# Altium schematic sheet supply_domain.schdoc
size 297 x 205 mm
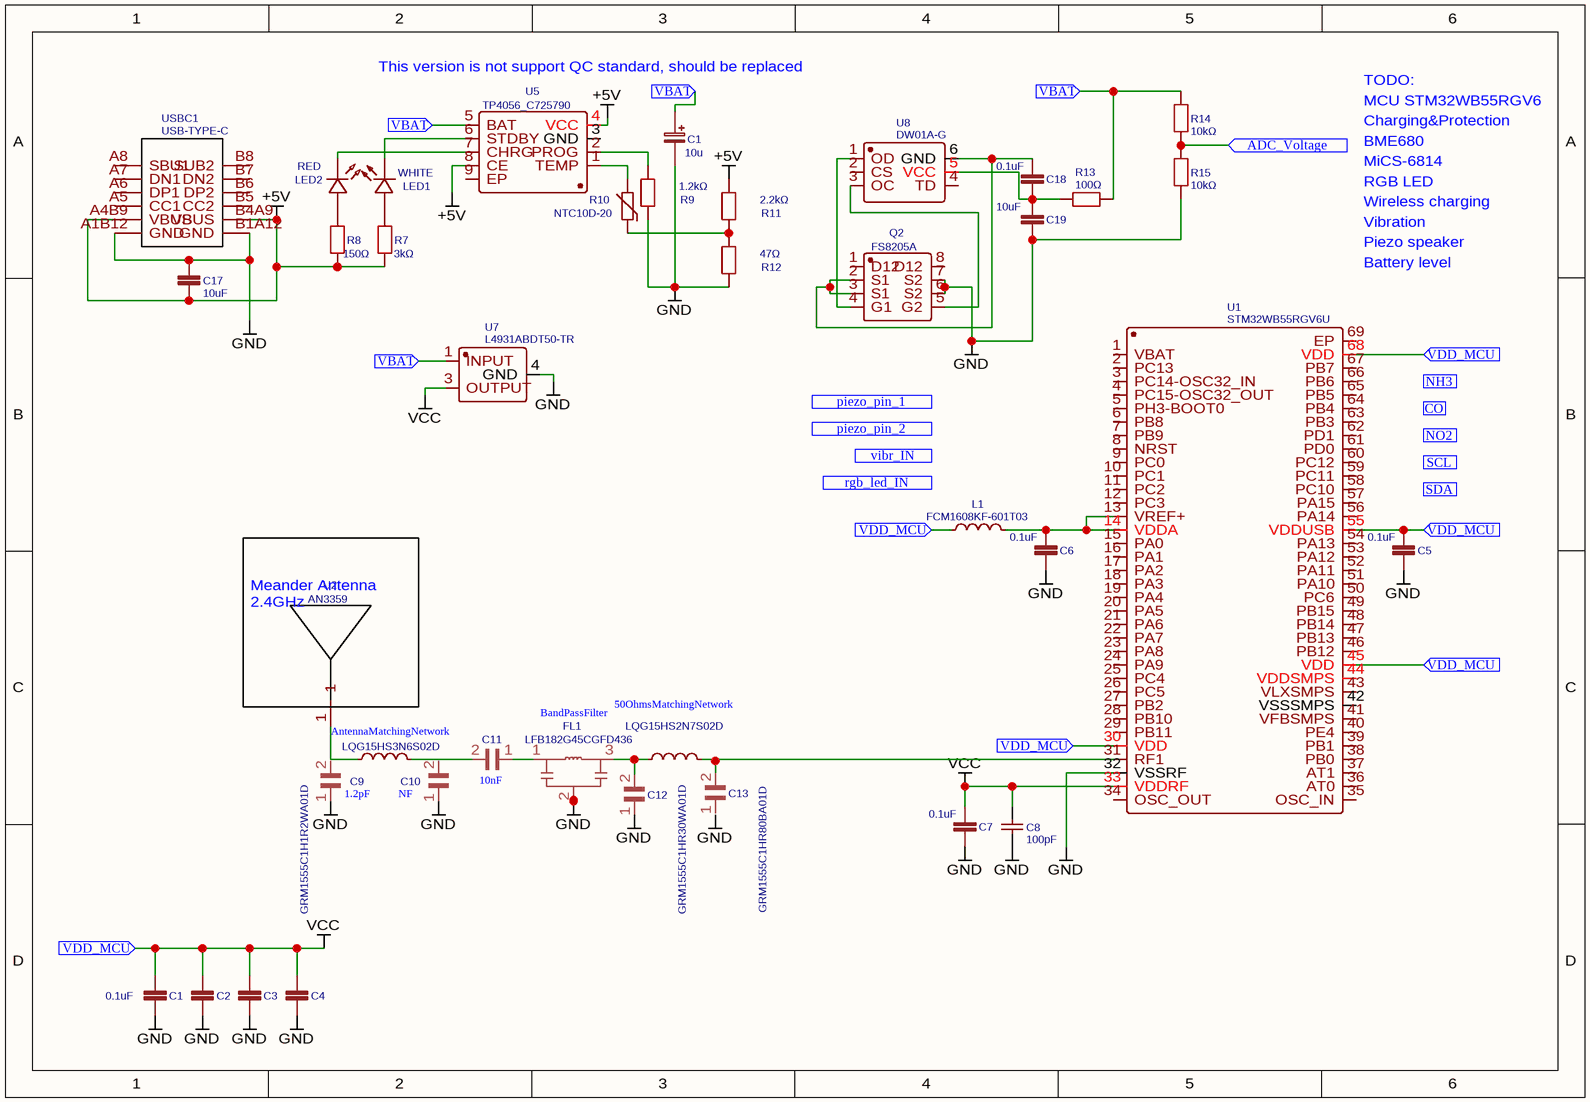
[diagram p0: supply_domain.schdoc]

## Parts
(Parts that share a designator on the sheet are numbered #1, #2 ... from top to bottom, then left to right.)
C1  0.1uF  [0603-CAP]
C2  0.1UF-25V(+80_-20%)(0603)  [0603-CAP]  (value not drawn)
C3  0.1UF-25V(+80_-20%)(0603)  [0603-CAP]  (value not drawn)
C4  0.1UF-25V(+80_-20%)(0603)  [0603-CAP]  (value not drawn)
C5  0.1uF  [0603-CAP]
C6  0.1uF  [0603-CAP]
C7  0.1uF  [0603-CAP]
C8  100pF  [C0603]
C9  GRM1555C1H1R2WA01D  [CAPC1005X55N]
C10  GRM1555C1H1R2WA01D  [CAPC1005X55N]  (value not drawn)
C11  GRM1555C1H1R2WA01D  [CAPC1005X55N]  (value not drawn)
C12  GRM1555C1HR30WA01D  [CAPC1005X55N]
C13  GRM1555C1HR80BA01D  [CAPC1005X55N]
C17  10uF  [0603-CAP]
C18  0.1uF  [0603-CAP]
C19  10uF  [0603-CAP]
FL1  LFB182G45CGFD436  [FIL_LFB182G45CGFD436]
L1  FCM1608KF-601T03  [L0603]
LED1  WHITE  [LED0805-FD]
LED2  RED  [LED0603-RD]
NO#1  LQG15HS3N6S02D  [L0402]
NO#2  LQG15HS2N7S02D  [L0402]
Q2  FS8205A  [TSSOP-8_L4.4-W3.0-P0.65-LS6.4-BL-2]
R7  3kΩ  [R0603]
R8  150Ω  [R0603]
R9  1.2kΩ  [R0603]
R10  NTC10D-20  [RES-TH_L22.0-W7.0-P7.50-D1.0-S1.00]
R11  2.2kΩ  [R0603]
R12  47Ω  [R0603]
R13  100Ω  [R0603]
R14  10kΩ  [R0603]
R15  10kΩ  [R0603]
U1  STM32WB55RGV6U  [VFQFPN-68_L8.0-W8.0-P0.40-TL-EP6.4]
U2  AN3359  [AN3359]
U5  TP4056_C725790  [ESOP-8_L4.9-W3.9-P1.27-LS6.0-BL-EP]
U6  electrolitic_cap_th_to_smd  [TH_CAP_TO_SMD]  (value not drawn)
U7  L4931ABDT50-TR  [DPAK_L6.5-W6.0-P2.29-LS9.9-BR]
U8  DW01A-G  [SOT-23-6_L2.9-W1.6-P0.95-LS2.8-BR]
USBC1  USB-TYPE-C  [USB-TYPE-C_20PIN-FEMALE_TYPE-C-31-M-14]

## Ports
ADC_Voltage (in), CO (in), NH3 (in), NO2 (in), piezo_pin_1 (in), piezo_pin_2 (in), rgb_led_IN (in), SCL (in), SDA (in), VBAT (in), VDD_MCU (in), vibr_IN (in)

## Nets
+5V: C17.1 R7.1 R8.1 R11.2 U5.4(VCC) U5.8(CE) USBC1.A4B9(VBUS) USBC1.B4A9(VBUS)
GND: C1.1 C1.2 C2.1 C2.2 C3.1 C3.2 C4.1 C4.2 C5.1 C5.2 C6.2 C7.1 C7.2 C8.1 C8.2 C9.1 C10.1 C12.1 C17.2 C19.2 FL1.2(GND) FL1.2_1(GND) L1.1 Q2.6(S2) Q2.7(S2) R9.1 R12.1 R15.2 U1.30(VDD) U1.32(VSSRF) U1.33(VDDRF) U1.45(VDD) U1.55(VDDUSB) U1.68(VDD) U6.2 U7.3(OUTPUT) U7.4(GND) USBC1.A1B12(GND) USBC1.B1A12(GND) ; port VDD_MCU  [also labelled VCC]
ADC_Voltage: R14.2 R15.1 ; port ADC_Voltage
AntennaMatchingNetwork: NO#1.1 U2.1
VBAT: R13.1 R14.1 U5.5(BAT) U6.1 U7.1(INPUT) ; port VBAT
NetC6_1: C6.1 L1.2 U1.13(VREF+) U1.14(VDDA)
NetC11_1: C11.1 FL1.1(IN)
NetC11_2: C11.2 NO#1.2
NetC12_2: C12.2 FL1.3(OUT) NO#2.1
NetC13_2: C13.2 NO#2.2 U1.31(RF1)
NetC18_1: C18.1 Q2.2(S1) Q2.3(S1) U8.6(GND)
NetC18_2: C18.2 C19.1 R13.2 U8.5(VCC)
NetLED1_1: LED1.1(A) R7.2
NetLED1_2: LED1.2(K) U5.6(STDBY)
NetLED2_1: LED2.1 U5.7(CHRG)
NetLED2_2: LED2.2 R8.2
NetQ2_4: Q2.4(G1) U8.1(OD)
NetQ2_5: Q2.5(G2) U8.3(OC)
NetR9_2: R9.2 U5.2(PROG)
NetR10_1: R10.1 R11.1 R12.2
NetR10_2: R10.2 U5.1(TEMP)

Not connected (* = marked no-connect by the designer): C9 2; C10 2; C13 1; Q2 1(D12) 8(D12); U1 1(VBAT) 2(PC13) 3(PC14-OSC32_IN) 4(PC15-OSC32_OUT) 5(PH3-BOOT0) 6(PB8) 7(PB9) 8(NRST) 9(PC0) 10(PC1) 11(PC2) 12(PC3) 15(PA0) 16(PA1) 17(PA2) 18(PA3) 19(PA4) 20(PA5) 21(PA6) 22(PA7) 23(PA8) 24(PA9) 25(PC4) 26(PC5) 27(PB2) 28(PB10) 29(PB11) 34(OSC_OUT) 35(OSC_IN) 36(AT0) 37(AT1) 38(PB0) 39(PB1) 40(PE4) 41(VFBSMPS) 42(VSSSMPS) 43(VLXSMPS) 44(VDDSMPS) 46(PB12) 47(PB13) 48(PB14) 49(PB15) 50(PC6) 51(PA10) 52(PA11) 53(PA12) 54(PA13) 56(PA14) 57(PA15) 58(PC10) 59(PC11) 60(PC12) 61(PD0) 62(PD1) 63(PB3) 64(PB4) 65(PB5) 66(PB6) 67(PB7) 69(EP); U5 3(GND) 9(EP); U8 2(CS) 4(TD); USBC1 A5(CC1) A6(DP1) A7(DN1) A8(SBU1) B5(CC2) B6(DP2) B7(DN2) B8(SUB2)

## Notes on the sheet
- This version is not support QC standard, should be replaced
- MCU STM32WB55RGV6
- TODO:
- Charging&Protection
- BME680
- MiCS-6814
- RGB LED
- Wireless charging
- Vibration
- Piezo speaker
- Battery level
- (near U2) Meander Antenna
  2.4GHz
- Labels drawn without touching a wire or pin: 1.2pF, 10nF, 50OhmsMatchingNetwork, BandPassFilter, GND, NF
- (in symbol electrolitic_cap_th_to_smd) C1; 10u

## Library data of the parts
C1 C5-C7 C18 = 0.1uF: description: CAP-00810; Contributor: SparkFun; spicePre: C; spiceSymbolName: 0.1UF-25V(+80_-20%)(0603)
C2-C4 = 0.1UF-25V(+80_-20%)(0603): description: CAP-00810; Contributor: SparkFun; spicePre: C; spiceSymbolName: 0.1UF-25V(+80_-20%)(0603)
C8 = 100pF: BOM_Manufacturer Part: GRM1885C1H101JA01D; BOM_Manufacturer: MuRata; nameAlias: Capacitance; BOM_Supplier: LCSC; BOM_Supplier Part: C71664; BOM_JLCPCB Part Class: Extended Part; spicePre: C; spiceSymbolName: GRM1885C1H101JA01D
C9-C11 = GRM1555C1H1R2WA01D: Contributor: Anderson Macedo; spicePre: C; spiceSymbolName: GRM1555C1H1R2WA01D
C12 = GRM1555C1HR30WA01D: Contributor: Anderson Macedo; spicePre: C; spiceSymbolName: GRM1555C1HR30WA01D
C13 = GRM1555C1HR80BA01D: Contributor: Anderson Macedo; spicePre: C; spiceSymbolName: GRM1555C1HR80BA01D
C17 C19 = 10uF: description: CAP-00810; Contributor: SparkFun; spicePre: C; spiceSymbolName: 0.1UF-25V(+80_-20%)(0603)
FL1 = LFB182G45CGFD436: Contributor: Anderson Macedo; spicePre: F; spiceSymbolName: LFB182G45CGFD436
L1 = FCM1608KF-601T03: BOM_Manufacturer: TAITEC; Contributor: LCSC; BOM_Supplier: LCSC; BOM_Supplier Part: C141723; BOM_Manufacturer Part: FCM1608KF-601T03; BOM_JLCPCB Part Class: Extended Part; spicePre: L; spiceSymbolName: FCM1608KF-601T03
LED1 = WHITE: BOM_Manufacturer: KENTO; BOM_Manufacturer Part: whiteLEDSMD; BOM_Supplier: LCSC; BOM_Supplier Part: C34499; BOM_JLCPCB Part Class: Basic Part; spicePre: L; spiceSymbolName: whiteLEDSMD
LED2 = RED: BOM_Manufacturer: null; BOM_Manufacturer Part: 贴片LED; Contributor: LCSC; BOM_Supplier: LCSC; BOM_Supplier Part: C9900008128; BOM_JLCPCB Part Class: Extended Part; spicePre: U; spiceSymbolName: 贴片LED_C9900008128
NO#1 = LQG15HS3N6S02D: BOM_Manufacturer: MuRata; Contributor: cyrilledecourtois; BOM_Température: -55 +125°C; BOM_Valeur: 3.6nH; BOM_Prix: 0.085; BOM_Manufacturer Part: LQG15HS3N6S02D; BOM_Supplier: Mouser; BOM_Supplier Part: 81-LQG15HS3N6S02D; link: https://www.mouser.fr/ProductDetail/Murata-Electronics/LQG15HS3N6S02D?qs=%2Fha2pyFadujBRa%2Fp5CVwGzDiTwg7pAvUcar2Z1OiPA%2FfvOHatjByeQ%3D%3D; spicePre: L; spiceSymbolName: LQG15HS3N6S02D
NO#2 = LQG15HS2N7S02D: BOM_Manufacturer: MuRata; Contributor: cyrilledecourtois; BOM_Température: -55 +125°C; BOM_Valeur: 2.7nH; BOM_Prix: 0.085; BOM_Manufacturer Part: LQG15HS2N7S02D; BOM_Supplier: Mouser; BOM_Supplier Part: 81-LQG15HS2N7S02D; link: https://www.mouser.fr/ProductDetail/Murata-Electronics/LQG15HS2N7S02D?qs=%2Fha2pyFadujt2OiWqNJoxRoxw7kBv0%252ByrT6n939VFw4zHSInabTFCw%3D%3D; spicePre: L; spiceSymbolName: LQG15HS2N7S02D
Q2 = FS8205A: BOM_Manufacturer: FORTUNE; BOM_Supplier: LCSC; BOM_Manufacturer Part: FS8205A; BOM_Supplier Part: C16052; BOM_JLCPCB Part Class: Extended Part; spicePre: Q; spiceSymbolName: FS8205A
R7 = 3kΩ: BOM_Manufacturer: Resistor.Today; BOM_Manufacturer Part: TCTR0603F47K0F3960T; Contributor: LCSC; BOM_Supplier: LCSC; BOM_Supplier Part: C525388; BOM_JLCPCB Part Class: Extended Part; spicePre: R; spiceSymbolName: TCTR0603F47K0F3960T
R8 = 150Ω: BOM_Manufacturer: Resistor.Today; BOM_Manufacturer Part: TCTR0603F47K0F3960T; Contributor: LCSC; BOM_Supplier: LCSC; BOM_Supplier Part: C525388; BOM_JLCPCB Part Class: Extended Part; spicePre: R; spiceSymbolName: TCTR0603F47K0F3960T
R9 = 1.2kΩ: BOM_Manufacturer: Resistor.Today; BOM_Manufacturer Part: TCTR0603F47K0F3960T; Contributor: LCSC; BOM_Supplier: LCSC; BOM_Supplier Part: C525388; BOM_JLCPCB Part Class: Extended Part; spicePre: R; spiceSymbolName: TCTR0603F47K0F3960T
R10 = NTC10D-20: BOM_Manufacturer: RUILON; BOM_Manufacturer Part: NTCThermistor; nameAlias: Value; BOM_Supplier: LCSC; BOM_Supplier Part: C42975; BOM_JLCPCB Part Class: Extended Part; spicePre: R; spiceSymbolName: NTCThermistor
R11 = 2.2kΩ: BOM_Manufacturer: Resistor.Today; BOM_Manufacturer Part: TCTR0603F47K0F3960T; Contributor: LCSC; BOM_Supplier: LCSC; BOM_Supplier Part: C525388; BOM_JLCPCB Part Class: Extended Part; spicePre: R; spiceSymbolName: TCTR0603F47K0F3960T
R12 = 47Ω: BOM_Manufacturer: Resistor.Today; BOM_Manufacturer Part: TCTR0603F47K0F3960T; Contributor: LCSC; BOM_Supplier: LCSC; BOM_Supplier Part: C525388; BOM_JLCPCB Part Class: Extended Part; spicePre: R; spiceSymbolName: TCTR0603F47K0F3960T
R13 = 100Ω: BOM_Manufacturer: Resistor.Today; BOM_Manufacturer Part: TCTR0603F47K0F3960T; Contributor: LCSC; BOM_Supplier: LCSC; BOM_Supplier Part: C525388; BOM_JLCPCB Part Class: Extended Part; spicePre: R; spiceSymbolName: TCTR0603F47K0F3960T
R14 R15 = 10kΩ: BOM_Manufacturer: Resistor.Today; BOM_Manufacturer Part: TCTR0603F47K0F3960T; Contributor: LCSC; BOM_Supplier: LCSC; BOM_Supplier Part: C525388; BOM_JLCPCB Part Class: Extended Part; spicePre: R; spiceSymbolName: TCTR0603F47K0F3960T
U1 = STM32WB55RGV6U: BOM_Manufacturer: ST(意法半导体); Contributor: LCSC; BOM_Supplier: LCSC; BOM_Supplier Part: C1558433; BOM_Manufacturer Part: STM32WB55RGV6U; Frequency: -; spicePre: U; spiceSymbolName: STM32WB55RGV6U
U2 = AN3359: Contributor: ktw07182; BOM_Manufacturer Part: N/A; BOM_Supplier Part: N/A; spicePre: U; spiceSymbolName: AN3359
U5 = TP4056_C725790: BOM_Manufacturer: UMW(Youtai Semiconductor Co., Ltd.); BOM_Manufacturer Part: TP4056; Contributor: LCSC; BOM_Supplier: LCSC; BOM_Supplier Part: C725790; BOM_JLCPCB Part Class: Extended Part; spicePre: U; spiceSymbolName: TP4056_C725790
U6 = electrolitic_cap_th_to_smd: Contributor: c3xp; spicePre: U; spiceSymbolName: electrolitic_cap_th_to_smd
U7 = L4931ABDT50-TR: BOM_Manufacturer: STMicroelectronics; Contributor: LCSC; BOM_Supplier: LCSC; BOM_Supplier Part: C283275; BOM_Manufacturer Part: L4931ABDT50-TR; BOM_JLCPCB Part Class: Extended Part; spicePre: U; spiceSymbolName: L4931ABDT50-TR
U8 = DW01A-G: BOM_Manufacturer: FORTUNE; Contributor: LCSC; BOM_Supplier: LCSC; BOM_Manufacturer Part: DW01A-G; BOM_Supplier Part: C61503; BOM_JLCPCB Part Class: Extended Part; spicePre: U; spiceSymbolName: DW01A-G
USBC1 = USB-TYPE-C: BOM_Manufacturer: Rectangular Connectors - Contacts; BOM_Manufacturer Part: TYPE-C-31-M-14; Contributor: Dragomir Liviu Marian; BOM_Supplier Part: C223907; spicePre: U; spiceSymbolName: USB-TYPE-C